# EAGLE design 23to27 (EAGLE 9.6.1)
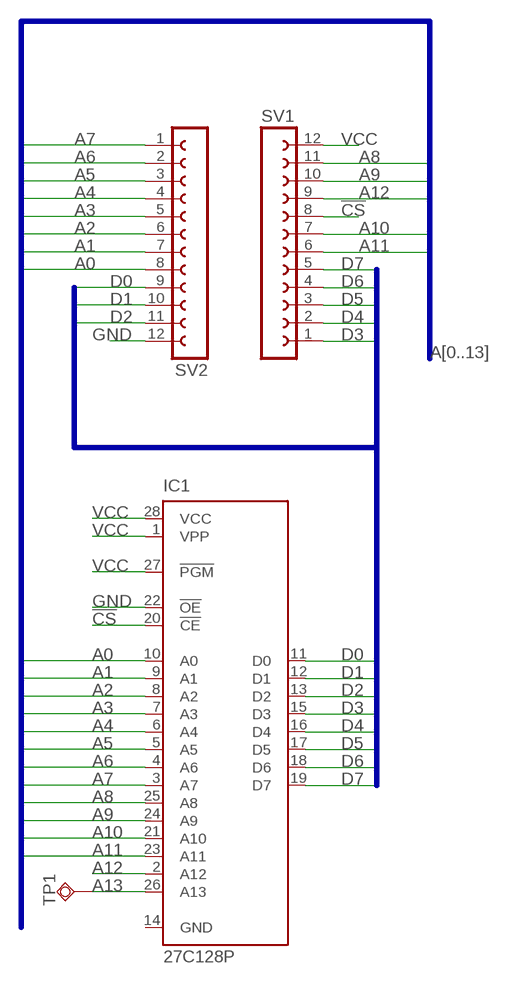
[diagram p0: schematic, sheet 1]

## Parts
IC1  27C128P  [DIL28-6]
SV1  FE12-1  [FE12]
SV2  FE12-1  [FE12]
TP1  TPSQTP16R  [TP16R]

## Nets
!CS: IC1.20(!CE) SV1.8
A0: IC1.10(A0) SV2.8
A1: IC1.9(A1) SV2.7
A2: IC1.8(A2) SV2.6
A3: IC1.7(A3) SV2.5
A4: IC1.6(A4) SV2.4
A5: IC1.5(A5) SV2.3
A6: IC1.4(A6) SV2.2
A7: IC1.3(A7) SV2.1
A8: IC1.25(A8) SV1.11
A9: IC1.24(A9) SV1.10
A10: IC1.21(A10) SV1.7
A11: IC1.23(A11) SV1.6
A12: IC1.2(A12) SV1.9
A13: IC1.26(A13) TP1.TP
D0: IC1.11(D0) SV2.9
D1: IC1.12(D1) SV2.10
D2: IC1.13(D2) SV2.11
D3: IC1.15(D3) SV1.1
D4: IC1.16(D4) SV1.2
D5: IC1.17(D5) SV1.3
D6: IC1.18(D6) SV1.4
D7: IC1.19(D7) SV1.5
GND: IC1.22(!OE) SV2.12
VCC: IC1.1(VPP) IC1.27(!PGM) IC1.28(VCC) SV1.12

## Buses
A[0..13]
D[0..7]

## Power pins joined to a net without a drawn wire
GND: IC1.14(GND)

## Library data of the parts
IC1 = microchip:27*128: CMOS EPROM 128 K (16 K x 8); OC_FARNELL: unknown; OC_NEWARK: unknown
SV1 SV2 = con-lsta:FE12-1: FEMALE HEADER; OC_FARNELL: unknown; OC_NEWARK: unknown
TP1 = testpad:TPSQ: Test pad

## Board
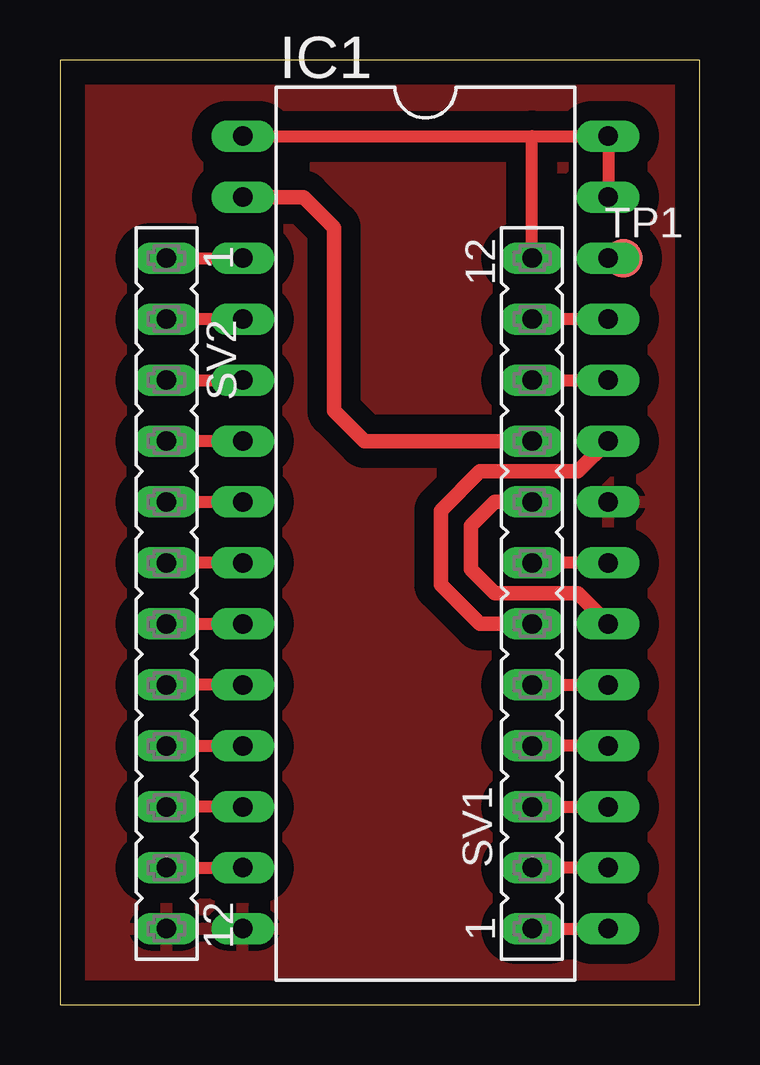
[diagram p1: board, top side]

Size 26.67 x 39.37 mm. Coordinates in mm from the lower left corner, seen from the top.
Outline: 0,0 26.67,0 26.67,39.37 0,39.37 0,0
Copper layers (1*16): Top 0.035mm / dielectric 1.5mm / Bottom 0.035mm
Design rules "default": minimum track width 6mil, minimum drill 0.35mm, track to track 6mil, track to pad 6mil, pad to pad 6mil, via to via 6mil, smd to smd 6mil, copper to edge 40mil, drill to drill 6mil, minimum pad ring 10mil, minimum via ring 8mil, stop-mask expansion 4mil, vias tented up to drill 0mil, thermal gap 10mil

### Footprints (pad centres in the part's own frame; a part is rotated, then mirrored left to right if it is on the bottom)
DIL28-6 = drill 0.813 long: 1 -16.51,-7.62; 2 -13.97,-7.62; 3 -11.43,-7.62; 4 -8.89,-7.62; 5 -6.35,-7.62; 6 -3.81,-7.62; 7 -1.27,-7.62; 8 1.27,-7.62; 9 3.81,-7.62; 10 6.35,-7.62; 11 8.89,-7.62; 12 11.43,-7.62; 13 13.97,-7.62; 14 16.51,-7.62; 15 16.51,7.62; 16 13.97,7.62; 17 11.43,7.62; 18 8.89,7.62; 19 6.35,7.62; 20 3.81,7.62; 21 1.27,7.62; 22 -1.27,7.62; 23 -3.81,7.62; 24 -6.35,7.62; 25 -8.89,7.62; 26 -11.43,7.62; 27 -13.97,7.62; 28 -16.51,7.62
FE12 = drill 0.813 long: 1 -13.97,0; 2 -11.43,0; 3 -8.89,0; 4 -6.35,0; 5 -3.81,0; 6 -1.27,0; 7 1.27,0; 8 3.81,0; 9 6.35,0; 10 8.89,0; 11 11.43,0; 12 13.97,0
TP16R = smd 1.6 x 1.6: TP 0,0

### Placement (x,y rotation side)
IC1  15.24,19.69 270 top
SV1  19.68,17.14 90 top
SV2  4.45,17.14 270 top
TP1  23.5,31.11 0 top

### Tracks (layer width: path | path; a pad name or v marks a point on that pad's centre or on a via)
!CS
  Top 0.61: SV1.8 18.14,20.95 17.14,19.95 17.14,18.14 18.14,17.14 21.59,17.14 IC1.20
A0
  Top 0.508: IC1.10 SV2.8
A1
  Top 0.508: SV2.7 IC1.9
A2
  Top 0.508: IC1.8 SV2.6
A3
  Top 0.508: SV2.5 IC1.7
A4
  Top 0.508: IC1.6 SV2.4
A5
  Top 0.508: SV2.3 IC1.5
A6
  Top 0.508: IC1.4 SV2.2
A7
  Top 0.508: SV2.1 IC1.3
A8
  Top 0.508: IC1.25 SV1.11
A9
  Top 0.508: SV1.10 IC1.24
A10
  Top 0.508: IC1.21 SV1.7
A11
  Top 0.61: IC1.23 21.59,22.23 17.51,22.23 15.88,20.59 15.88,17.51 17.51,15.87 SV1.6
A12
  Top 0.508: 19.47,23.49 SV1.9
  Top 0.61: IC1.2 10.16,33.65 11.43,32.38 11.43,24.77 12.7,23.49 19.47,23.49
A13
  Top 0.508: IC1.26 TP1.TP
D0
  Top 0.508: SV2.9 IC1.11
D1
  Top 0.508: IC1.12 SV2.10
D2
  Top 0.508: SV2.11 IC1.13
D3
  Top 0.508: SV1.1 IC1.15
D4
  Top 0.508: IC1.16 SV1.2
D5
  Top 0.508: SV1.3 IC1.17
D6
  Top 0.508: IC1.18 SV1.4
D7
  Top 0.508: SV1.5 IC1.19
GND
  pour Top (isolate 0.813): 0,39.37 26.67,39.37 26.67,0 0,0
VCC
  Top 0.508: IC1.27 IC1.28 19.68,36.2 | IC1.1 19.68,36.2 | SV1.12 19.68,36.2